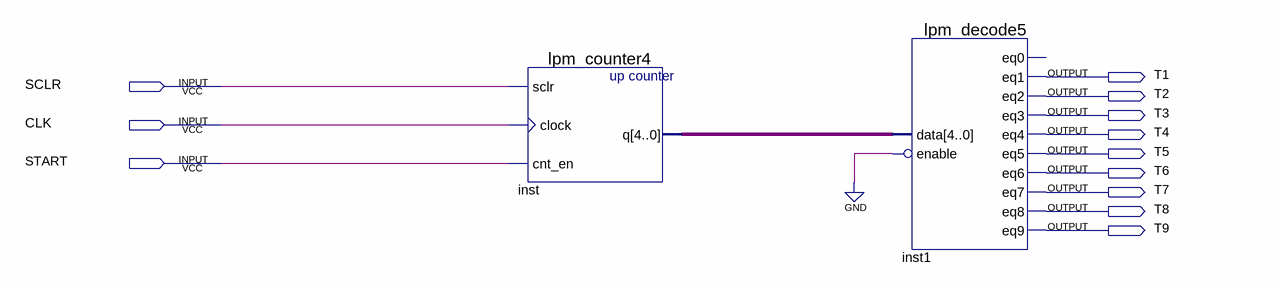
[diagram p0: schematic sheet]
// Quartus schematic DCa.bdf as structural Verilog: 2 symbols, 12 pins
module DCa (
  input  SCLR,
  input  CLK,
  input  START,
  output T1,
  output T2,
  output T3,
  output T4,
  output T5,
  output T6,
  output T7,
  output T8,
  output T9
);

  wire [4:0] inst_q;

  lpm_counter4 inst (.sclr(SCLR), .clock(CLK), .cnt_en(START), .q(inst_q));
  lpm_decode5 inst1 (
    .data(inst_q), .enable(~1'b0), .eq1(T1), .eq2(T2), .eq3(T3), .eq4(T4), .eq5(T5), .eq6(T6), .eq7(T7),
    .eq8(T8), .eq9(T9));  // open: eq0
endmodule
